# Altium schematic sheet STM32_3_Sheet3.SchDoc
size A4
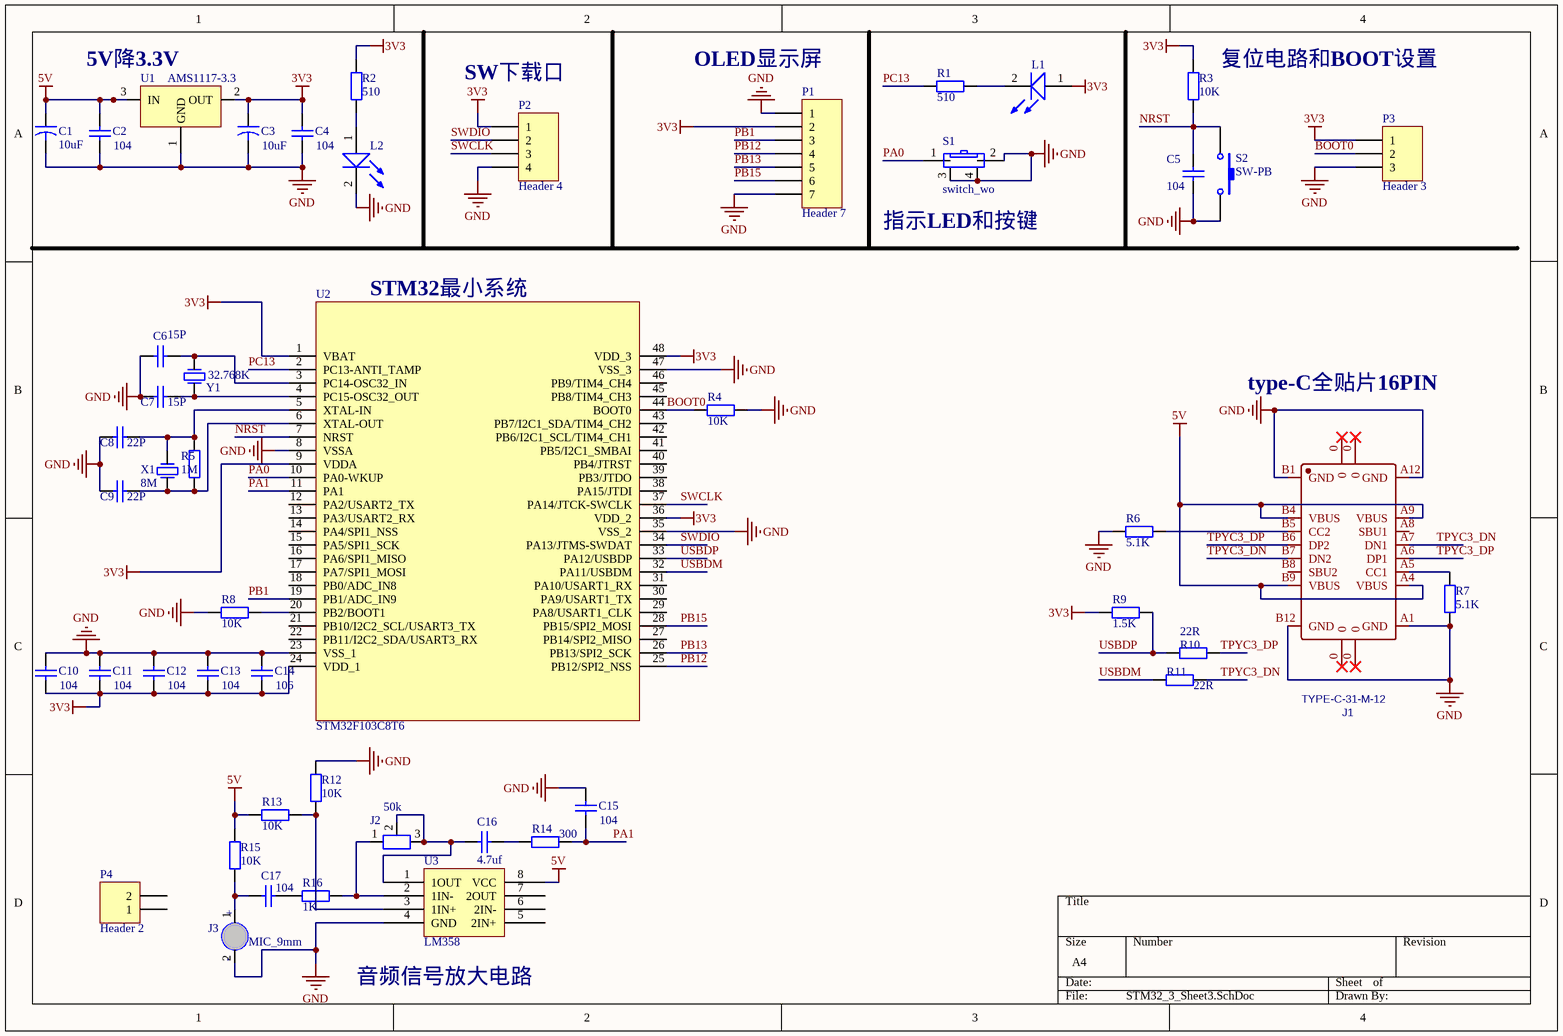
[diagram p0: STM32_3_Sheet3.SchDoc]

## Parts
C1  10uF  [RC0805]
C2  104  [RC0603]
C3  10uF  [RC0805]
C4  104  [RC0603]
C5  104  [RC0603]
C6  15P  [RC0603]
C7  15P  [RC0603]
C8  22P  [RC0603]
C9  22P  [RC0603]
C10  104  [RC0603]
C11  104  [RC0603]
C12  104  [RC0603]
C13  104  [RC0603]
C14  106  [RC0805]
C15  104  [RC0603]
C16  4.7uf  [RC0805]
C17  104  [RC0603]
J1  TYPE-C-31-M-12  [USB-TYPE-C_16PIN-MALE-TYPE-C-31-M-12]
J2  50k  [rv09]
J3  MIC_9mm  [MIC9*7MM]
L1  1  [LED0805]  (value not drawn)
L2  1  [LED0805]  (value not drawn)
P1  Header 7  [HDR1X7]
P2  Header 4  [HDR1X4]
P3  Header 3  [HDR1X3]
P4  Header 2  [HDR1X2]
R1  510  [RC0603]
R2  510  [RC0603]
R3  10K  [RC0603]
R4  10K  [RC0603]
R5  1M  [RC0603]
R6  5.1K  [RC0805]
R7  5.1K  [RC0805]
R8  10K  [RC0603]
R9  1.5K  [RC0805]
R10  22R  [RC0603]
R11  22R  [RC0603]
R12  10K  [RC0603]
R13  10K  [RC0603]
R14  300  [RC0805]
R15  10K  [RC0603]
R16  1K  [RC0805]
S1  switch_wo  [TSW DIP-3*6*5_V]
S2  SW-PB  [SMT-KEY]
U1  AMS1117-3.3  [SOT89_M]
U2  STM32F103C8T6  [LQFP48]
U3  LM358  [SOP8_M]
X1  8M  [OSC 5032-2P]
Y1  32.768K  [OSC 3215-2P]

## Nets
3V3: C3.1 C4.2 C10.1 C11.1 C12.1 C13.1 C14.1 L1.1 P1.2 P2.1 P3.1 R2.2 R3.2 R9.1 U1.2(OUT) U2.1(VBAT) U2.9(VDDA) U2.24(VDD_1) U2.36(VDD_2) U2.48(VDD_3)
5V: C1.1 C2.2 J1.A4(VBUS) J1.A9(VBUS) J1.B4(VBUS) J1.B9(VBUS) R13.2 R15.1 U1.3(IN) U3.8(VCC)
GND: C1.2 C2.1 C3.2 C4.1 C5.2 C6.1 C7.2 C8.2 C9.2 C10.2 C11.2 C12.2 C13.2 C14.2 C15.2 J1.A1(GND) J1.A12(GND) J1.B1(GND) J1.B12(GND) J3.2 L2.2 P1.1 P1.7 P2.4 P3.3 R4.1 R6.2 R7.2 R8.2 R12.2 S1.2 S1.3 S1.4 S2.2 U1.1(GND) U2.8(VSSA) U2.23(VSS_1) U2.35(VSS_2) U2.47(VSS_3) U3.4(GND)
BOOT0: P3.2 R4.2 U2.44(BOOT0)
NRST: C5.1 R3.1 S2.1 U2.7(NRST)
PA0: S1.1 U2.10(PA0-WKUP)
PA1: C15.1 R14.2 U2.11(PA1)
PB1: P1.3 U2.19(PB1/ADC_IN9)
PB12: P1.4 U2.25(PB12/SPI2_NSS)
PB13: P1.5 U2.26(PB13/SPI2_SCK)
PB15: P1.6 U2.28(PB15/SPI2_MOSI)
PC13: R1.1 U2.2(PC13-ANTI_TAMP)
SWCLK: P2.3 U2.37(PA14/JTCK-SWCLK)
SWDIO: P2.2 U2.34(PA13/JTMS-SWDAT)
TPYC3_DN: J1.A7(DN1) J1.B7(DN2) R11.1
TPYC3_DP: J1.A6(DP1) J1.B6(DP2) R10.1
USBDM: R11.2 U2.32(PA11/USBDM)
USBDP: R9.2 R10.2 U2.33(PA12/USBDP)
NetC6_2: C6.2 U2.3(PC14-OSC32_IN) Y1.1
NetC7_1: C7.1 U2.4(PC15-OSC32_OUT) Y1.2
NetC8_1: C8.1 R5.2 U2.5(XTAL-IN) X1.1
NetC9_1: C9.1 R5.1 U2.6(XTAL-OUT) X1.2
NetC16_1: C16.1 R14.1
NetC16_2: C16.2 J2.2 J2.3 U3.1(1OUT)
NetC17_1: C17.1 R16.1
NetC17_2: C17.2 J3.1 R15.2
NetJ1_A5: J1.A5(CC1) R7.1
NetJ1_B5: J1.B5(CC2) R6.1
NetJ2_1: J2.1 R16.2 U3.2(1IN-)
NetL1_2: L1.2 R1.2
NetL2_1: L2.1 R2.1
NetR8_1: R8.1 U2.20(PB2/BOOT1)
NetR12_1: R12.1 R13.1 U3.3(1IN+)

Not connected (* = marked no-connect by the designer): J1 0* A8(SBU1) B8(SBU2); P4 1 2; U2 12(PA2/USART2_TX) 13(PA3/USART2_RX) 14(PA4/SPI1_NSS) 15(PA5/SPI1_SCK) 16(PA6/SPI1_MISO) 17(PA7/SPI1_MOSI) 18(PB0/ADC_IN8) 21(PB10/I2C2_SCL/USART3_TX) 22(PB11/I2C2_SDA/USART3_RX) 27(PB14/SPI2_MISO) 29(PA8/USART1_CLK) 30(PA9/USART1_TX) 31(PA10/USART1_RX) 38(PA15/JTDI) 39(PB3/JTDO) 40(PB4/JTRST) 41(PB5/I2C1_SMBAI) 42(PB6/I2C1_SCL/TIM4_CH1) 43(PB7/I2C1_SDA/TIM4_CH2) 45(PB8/TIM4_CH3) 46(PB9/TIM4_CH4); U3 5(2IN+) 6(2IN-) 7(2OUT)

## Notes on the sheet
- (near U1) 5V降3.3V
- (near P2) SW下载口
- (near P1) OLED显示屏
- (near R3) 复位电路和BOOT设置
- (near S1) 指示LED和按键
- STM32最小系统
- type-C全贴片16PIN
- (near U3) 音频信号放大电路
- (in symbol MIC) +; -

## Library data of the parts
C1 C3 = Cap2: Capacitor; Published: 23-Sep-2002; PackageReference: CAPR5-4X5; Publisher: Altium Limited; PackageDescription: Capacitor; 2 Leads
  C3: Value: 10uF
C2 C4-C17 = Cap: Capacitor; Published: 8-Jun-2000; LatestRevisionDate: 17-Jul-2002; LatestRevisionNote: Re-released for DXP Platform.; PackageReference: RAD-0.3; Publisher: Altium Limited; PackageDescription: Radial Cap, Thru-Hole; 2 Leads; 0.3 in Pin Spacing
  C2 C4 C5 C10-C13 C15 C17: Value: 104
  C6 C7: Value: 15P
  C8 C9: Value: 22P
  C14: Value: 106
  C16: Value: 4.7uf
J2 = RES_adjust: 滑动变阻器
J3 = MIC: 咪头
L1 L2 = LED
P1 = Header 7: Header, 7-Pin; LatestRevisionDate: 17-Jul-2002; LatestRevisionNote: Re-released for DXP Platform.; Publisher: Altium Limited
P2 = Header 4: Header, 4-Pin; LatestRevisionDate: 17-Jul-2002; LatestRevisionNote: Re-released for DXP Platform.; Publisher: Altium Limited
P3 = Header 3: Header, 3-Pin; LatestRevisionDate: 17-Jul-2002; LatestRevisionNote: Re-released for DXP Platform.; Publisher: Altium Limited
P4 = Header 2: Header, 2-Pin; LatestRevisionDate: 17-Jul-2002; LatestRevisionNote: Re-released for DXP Platform.; Publisher: Altium Limited
R1-R16 = Res2: Resistor; Published: 8-Jun-2000; LatestRevisionDate: 17-Jul-2002; LatestRevisionNote: Re-released for DXP Platform.; PackageReference: AXIAL-0.4; Publisher: Altium Limited; PackageDescription: Axial Device, Thru-Hole; 2 Leads; 0.4 in Pin Spacing
  R3 R4 R8 R12 R13 R15: Value: 10K
  R5: Value: 1M
  R6 R7: Value: 5.1K
  R9: Value: 1.5K
  R10 R11: Value: 22R
  R14: Value: 300
  R16: Value: 1K
S1 = switch_wo: 卧式开关
S2 = SW-PB: Switch; Published: 24-Mar-1999; LatestRevisionDate: 17-Jul-2002; LatestRevisionNote: Re-released for DXP Platform.; PackageReference: SPST-2; Publisher: Altium Limited; PackageDescription: Switch; 2 Leads
U1 = AMS1117-3.3: 5V稳3.3V
U2 = STM32F103C8T6: STM32
U3 = LM358: 音频放大
X1 Y1 = Y1: 晶振